# Altium schematic sheet 16 PM8916_SMPS.SchDoc
size 868 x 576 mm
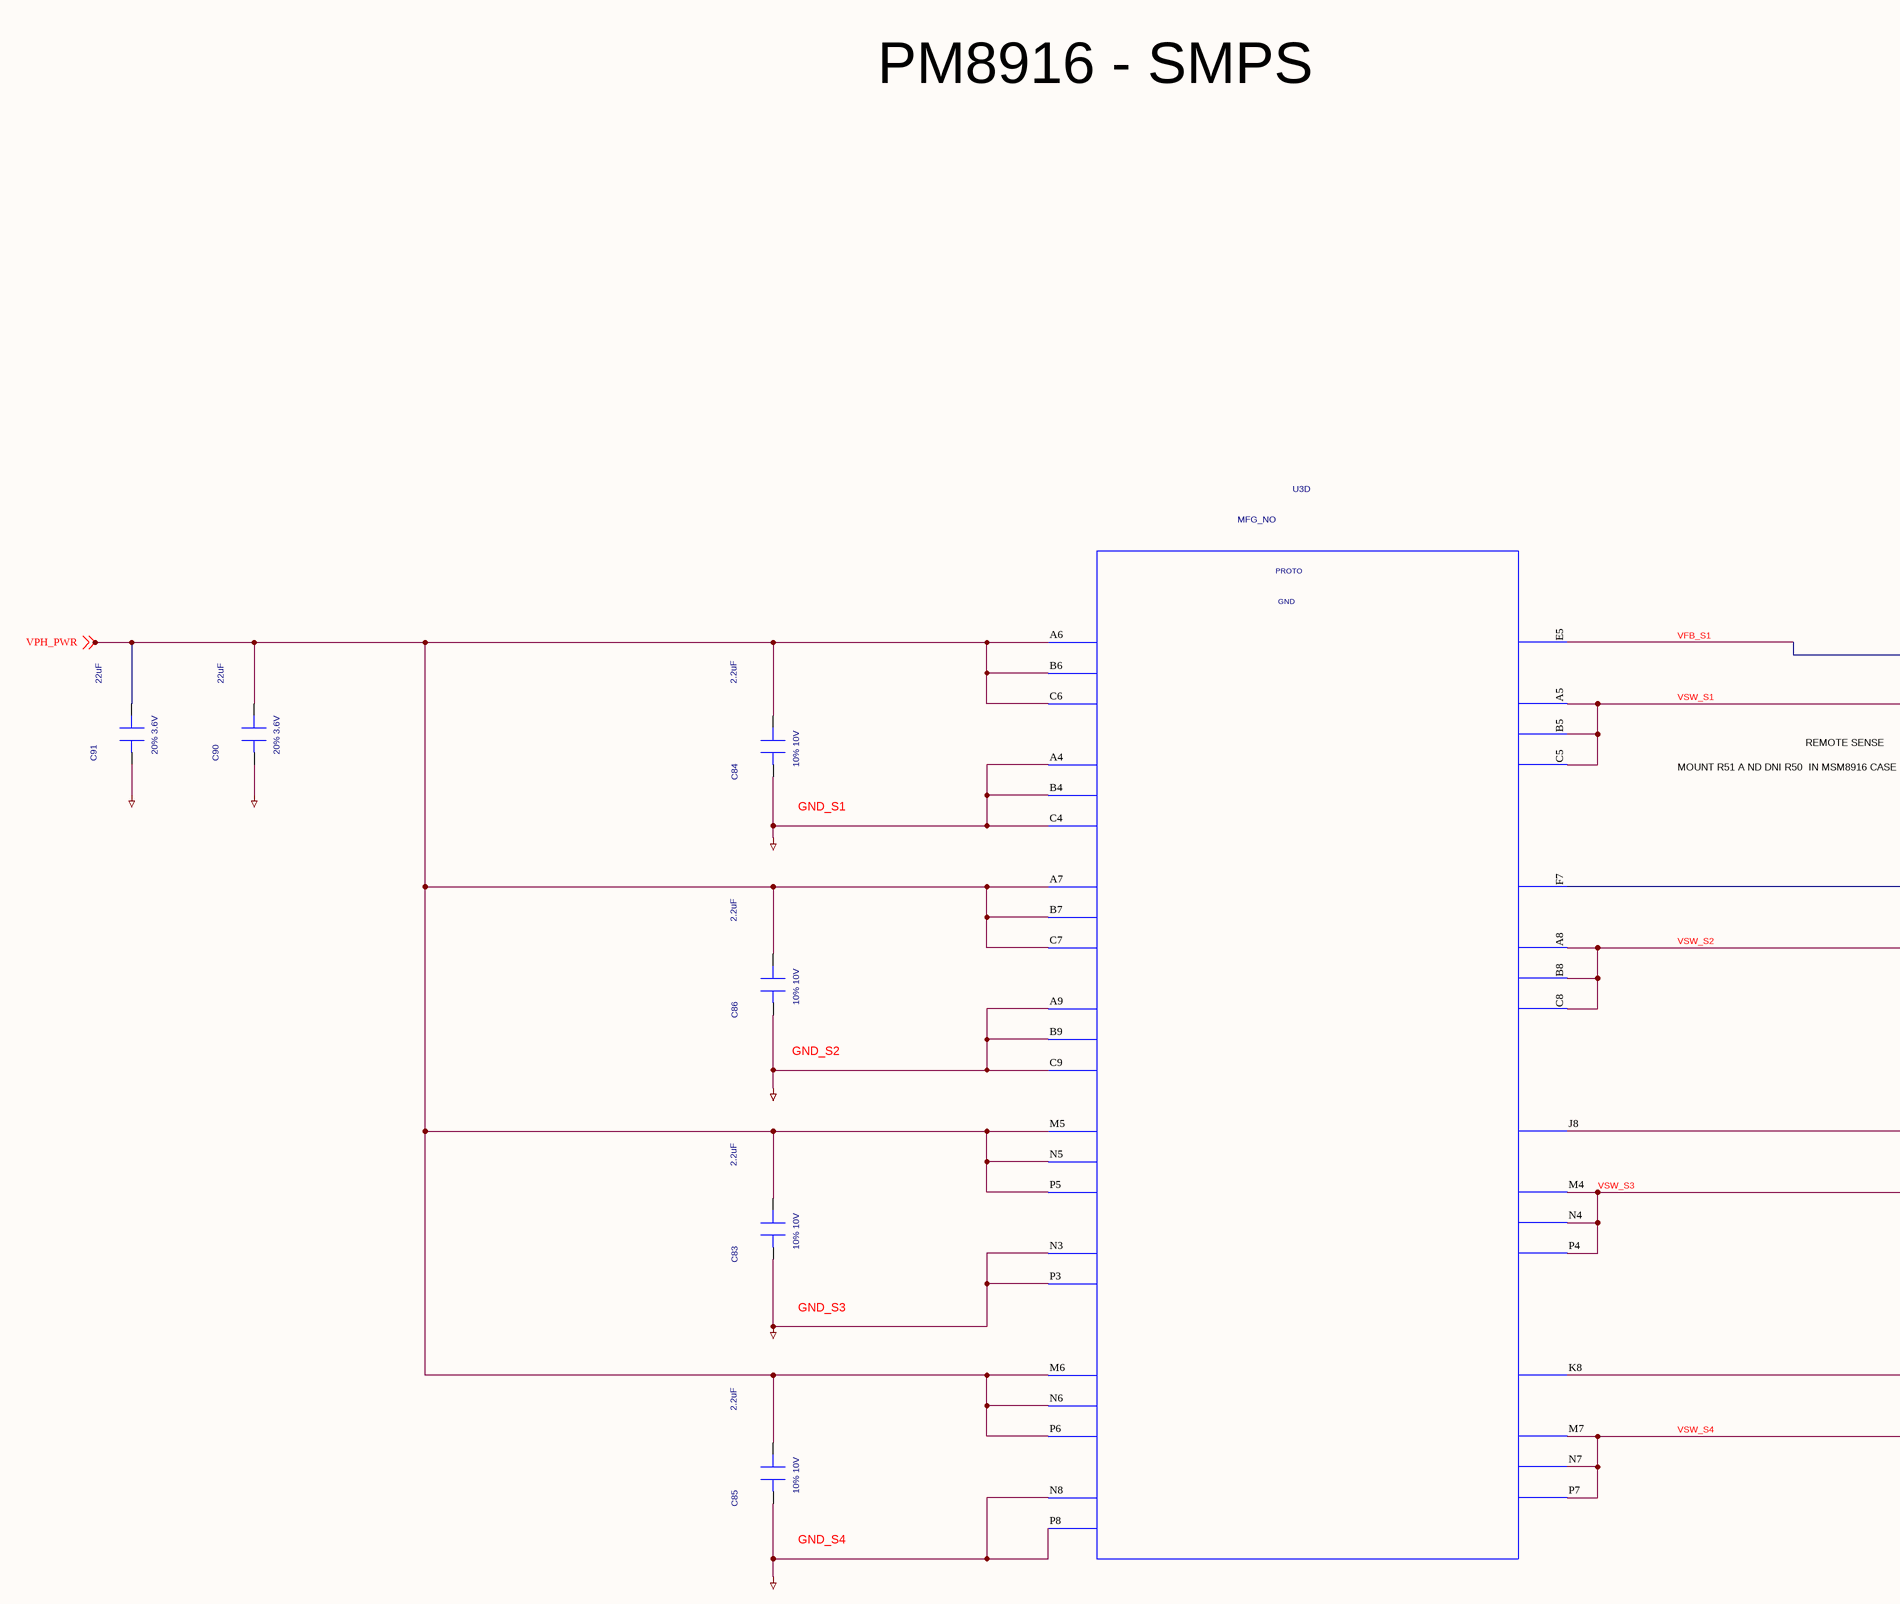
[diagram p0: 16 PM8916_SMPS.SchDoc, top left]
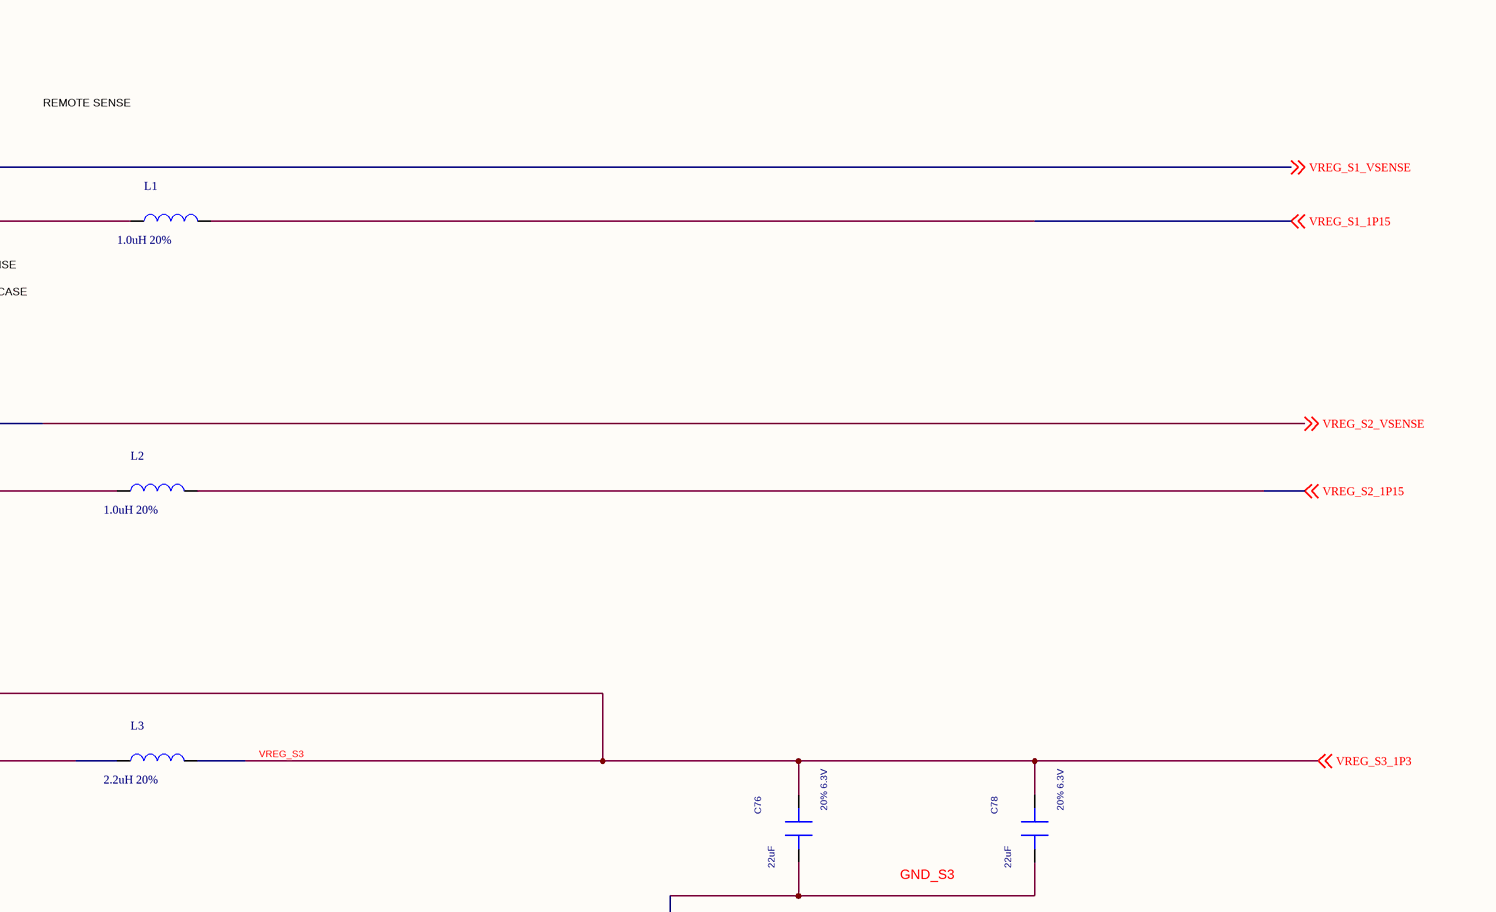
[diagram p1: 16 PM8916_SMPS.SchDoc, top right]
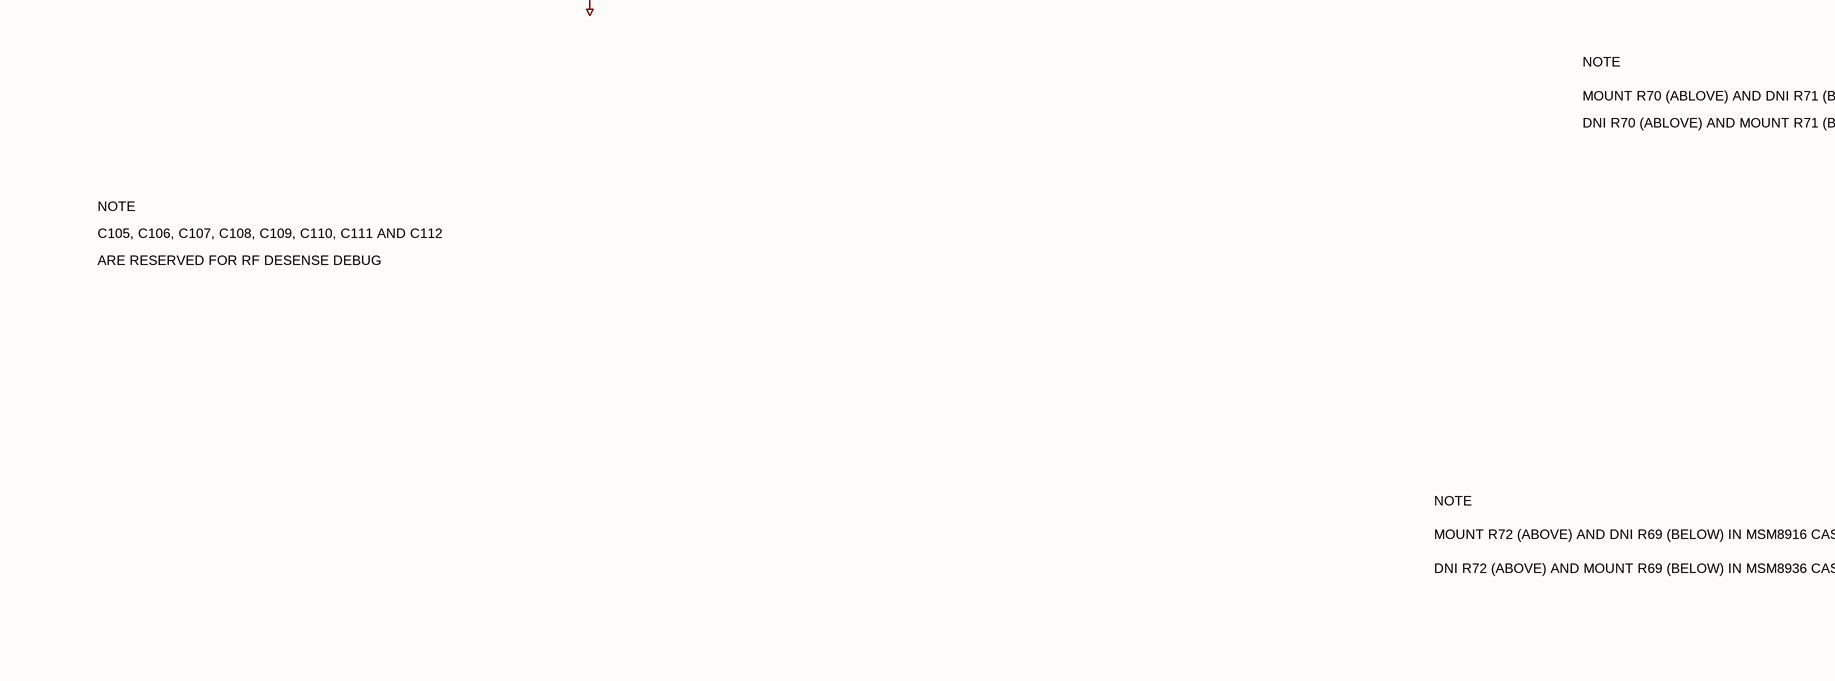
[diagram p2: 16 PM8916_SMPS.SchDoc, bottom left]
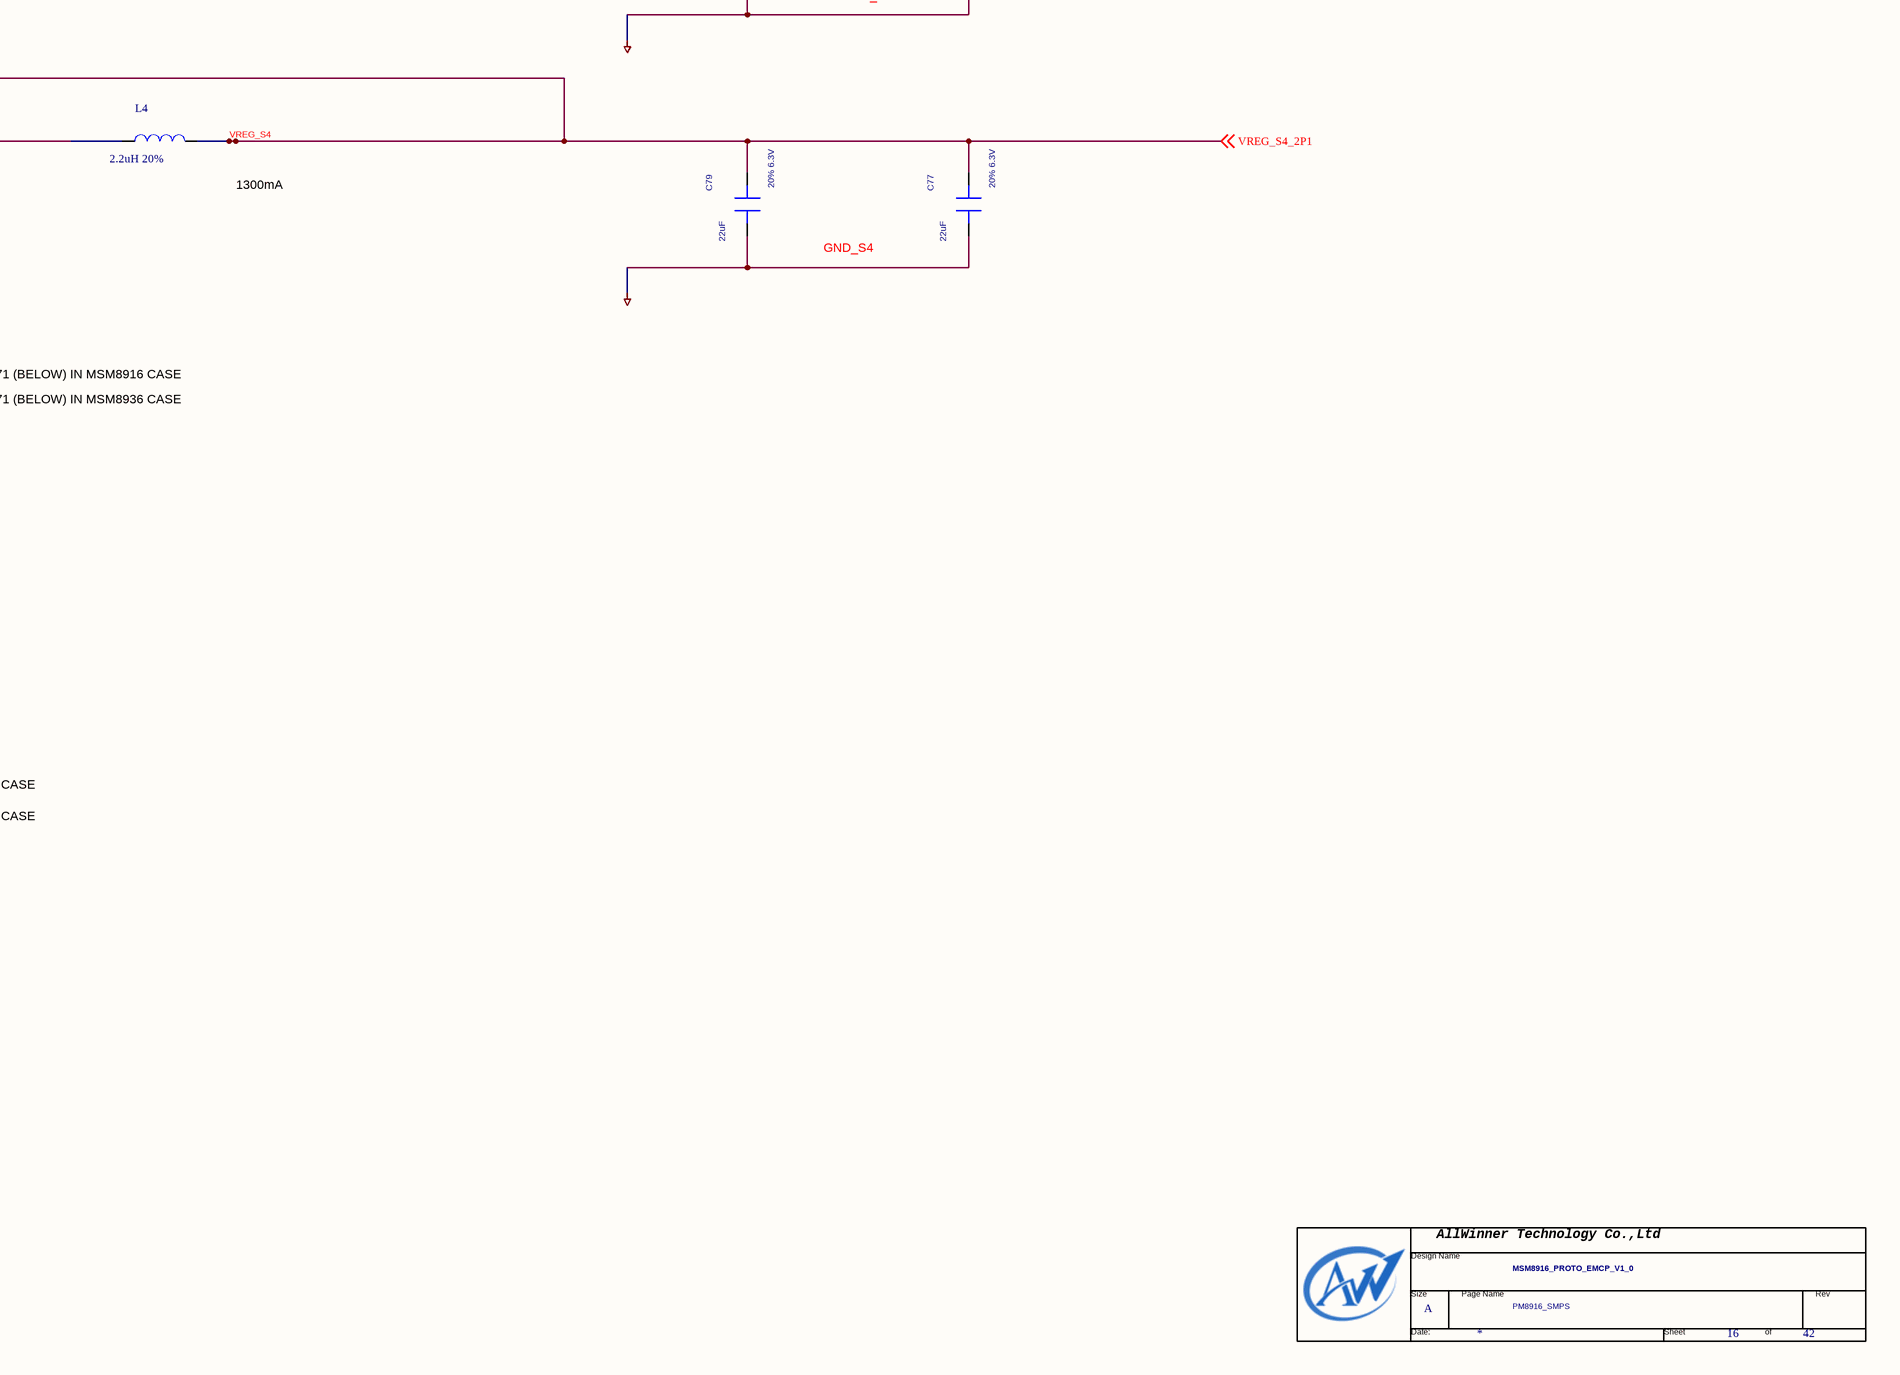
[diagram p3: 16 PM8916_SMPS.SchDoc, bottom right]

## Parts
*  Page Count: 42  Page Number: 16  Page Size: A  Title: MSM8916_PROTO_EMCP_V1_0  Doc: PM8916_SMPS  (hidden comment: TitleBlock0-AW)  (graphical)
C76  22uF  Tolerance: 20% 6.3V  [c0402]
C77  22uF  Tolerance: 20% 6.3V  [c0402]
C78  22uF  Tolerance: 20% 6.3V  [c0402]
C79  22uF  Tolerance: 20% 6.3V  [c0402]
C83  2.2uF  Tolerance: 10% 10V  [c0402]
C84  2.2uF  Tolerance: 10% 10V  [c0402]
C85  2.2uF  Tolerance: 10% 10V  [c0402]
C86  2.2uF  Tolerance: 10% 10V  [c0402]
C90  22uF  Tolerance: 20% 3.6V  [c0402]
C91  22uF  Tolerance: 20% 3.6V  [c0402]
L1  1.0uH 20%  [c0402]
L2  1.0uH 20%  [c0402]
L3  2.2uH 20%  [c0402]
L4  2.2uH 20%  [c0402]
U3  SYMNAME: GND  PART_ID: MFG_NO  BLOCKID: PROTO  [PM-8916-0-176NSP-TR-00-0]  (hidden comment: ASIC_PM8916)  (part D of 7)

## Nets
DGND: C76.1(POS) C77.1(POS) C78.1(POS) C79.1(POS) C83.1(POS) C84.1(POS) C85.1(POS) C86.1(POS) C90.1(POS) C91.1(POS) U3.A4(GND_S1_1) U3.A9(GND_S2_1) U3.B4(GND_S1_2) U3.B9(GND_S2_2) U3.C4(GND_S1_3) U3.C9(GND_S2_3) U3.N3(GND_S3_1) U3.N8(GND_S4_1) U3.P3(GND_S3_2) U3.P8(GND_S4_2)
VFB_S1: U3.E5(VFB_S1) ; off-sheet VREG_S1_VSENSE  [also labelled VREG_S1_VSENSE]
VPH_PWR: C83.2(NEG) C84.2(NEG) C85.2(NEG) C86.2(NEG) C90.2(NEG) C91.2(NEG) U3.A6(VIN_S1_1) U3.A7(VIN_S2_1) U3.B6(VIN_S1_2) U3.B7(VIN_S2_2) U3.C6(VIN_S1_3) U3.C7(VIN_S2_3) U3.M5(VIN_S3_1) U3.M6(VIN_S4_1) U3.N5(VIN_S3_2) U3.N6(VIN_S4_2) U3.P5(VIN_S3_3) U3.P6(VIN_S4_3) ; off-sheet VPH_PWR
VREG_S1_1P15: L1.2 ; off-sheet VREG_S1_1P15
VREG_S2_1P15: L2.2 ; off-sheet VREG_S2_1P15
VREG_S2_VSENSE: U3.F7(VFB_S2) ; off-sheet VREG_S2_VSENSE
VREG_S3: C76.2(NEG) C78.2(NEG) L3.2 U3.J8(VFB_S3) ; off-sheet VREG_S3_1P3  [also labelled VREG_S3_1P3]
VREG_S4: C77.2(NEG) C79.2(NEG) L4.2 U3.K8(VFB_S4) ; off-sheet VREG_S4_2P1  [also labelled VREG_S4_2P1]
VSW_S1: L1.1 U3.A5(VSW_S1_1) U3.B5(VSW_S1_2) U3.C5(VSW_S1_3)
VSW_S2: L2.1 U3.A8(VSW_S2_1) U3.B8(VSW_S2_2) U3.C8(VSW_S2_3)
VSW_S3: L3.1 U3.M4(VSW_S3_1) U3.N4(VSW_S3_2) U3.P4(VSW_S3_3)
VSW_S4: L4.1 U3.M7(VSW_S4_1) U3.N7(VSW_S4_2) U3.P7(VSW_S4_3)

## Notes on the sheet
- PM8916 - SMPS
- REMOTE SENSE
- MOUNT R51 A ND DNI R50  IN MSM8916 CASE
- (near C84) GND_S1
- (near C86) GND_S2
- GND_S3
- 1300mA
- GND_S4
- NOTE
- DNI R70 (ABLOVE) AND MOUNT R71 (BELOW) IN MSM8936 CASE
- MOUNT R70 (ABLOVE) AND DNI R71 (BELOW) IN MSM8916 CASE
- ARE RESERVED FOR RF DESENSE DEBUG
- C105, C106, C107, C108, C109, C110, C111 AND C112
- MOUNT R72 (ABOVE) AND DNI R69 (BELOW) IN MSM8916 CASE
- DNI R72 (ABOVE) AND MOUNT R69 (BELOW) IN MSM8936 CASE
- (in symbol TitleBlock0-AW) AllWinner Technology Co.,Ltd; Design Name; Size; Page Name; Rev; Date:; Sheet; of

## Library data of the parts
C76-C79 C83-C86 C90 C91 = CAP#1: PART_NUMBER: MCN_NO; PART_ID: MFG_NO; OriginalSymbolOrigin: (-75,50); VOLT: ?V; SYMNAME: CAP; CDS_LMAN_SYM_OUTLINE: -25,50,25,-50; PACK_TYPE: ?
L1-L4 = INDUCTOR_0
U3 = ASIC_PM8916: PART_NUMBER: MCN_NO; OriginalSymbolOrigin: (-1050,1125); SPLIT_INST: TRUE; CDS_LMAN_SYM_OUTLINE: -850,1125,875,-1250; CDS_LMAN_SPLIT_NUMBER: 1 of 7; PACK_TYPE: ?
* = TitleBlock0-AW: RevCode: ?; Page Create Date: March  8, 1995; Page Modify Date: *